# Altium schematic sheet STSPIN32F0A ESC4.SchDoc
size A3
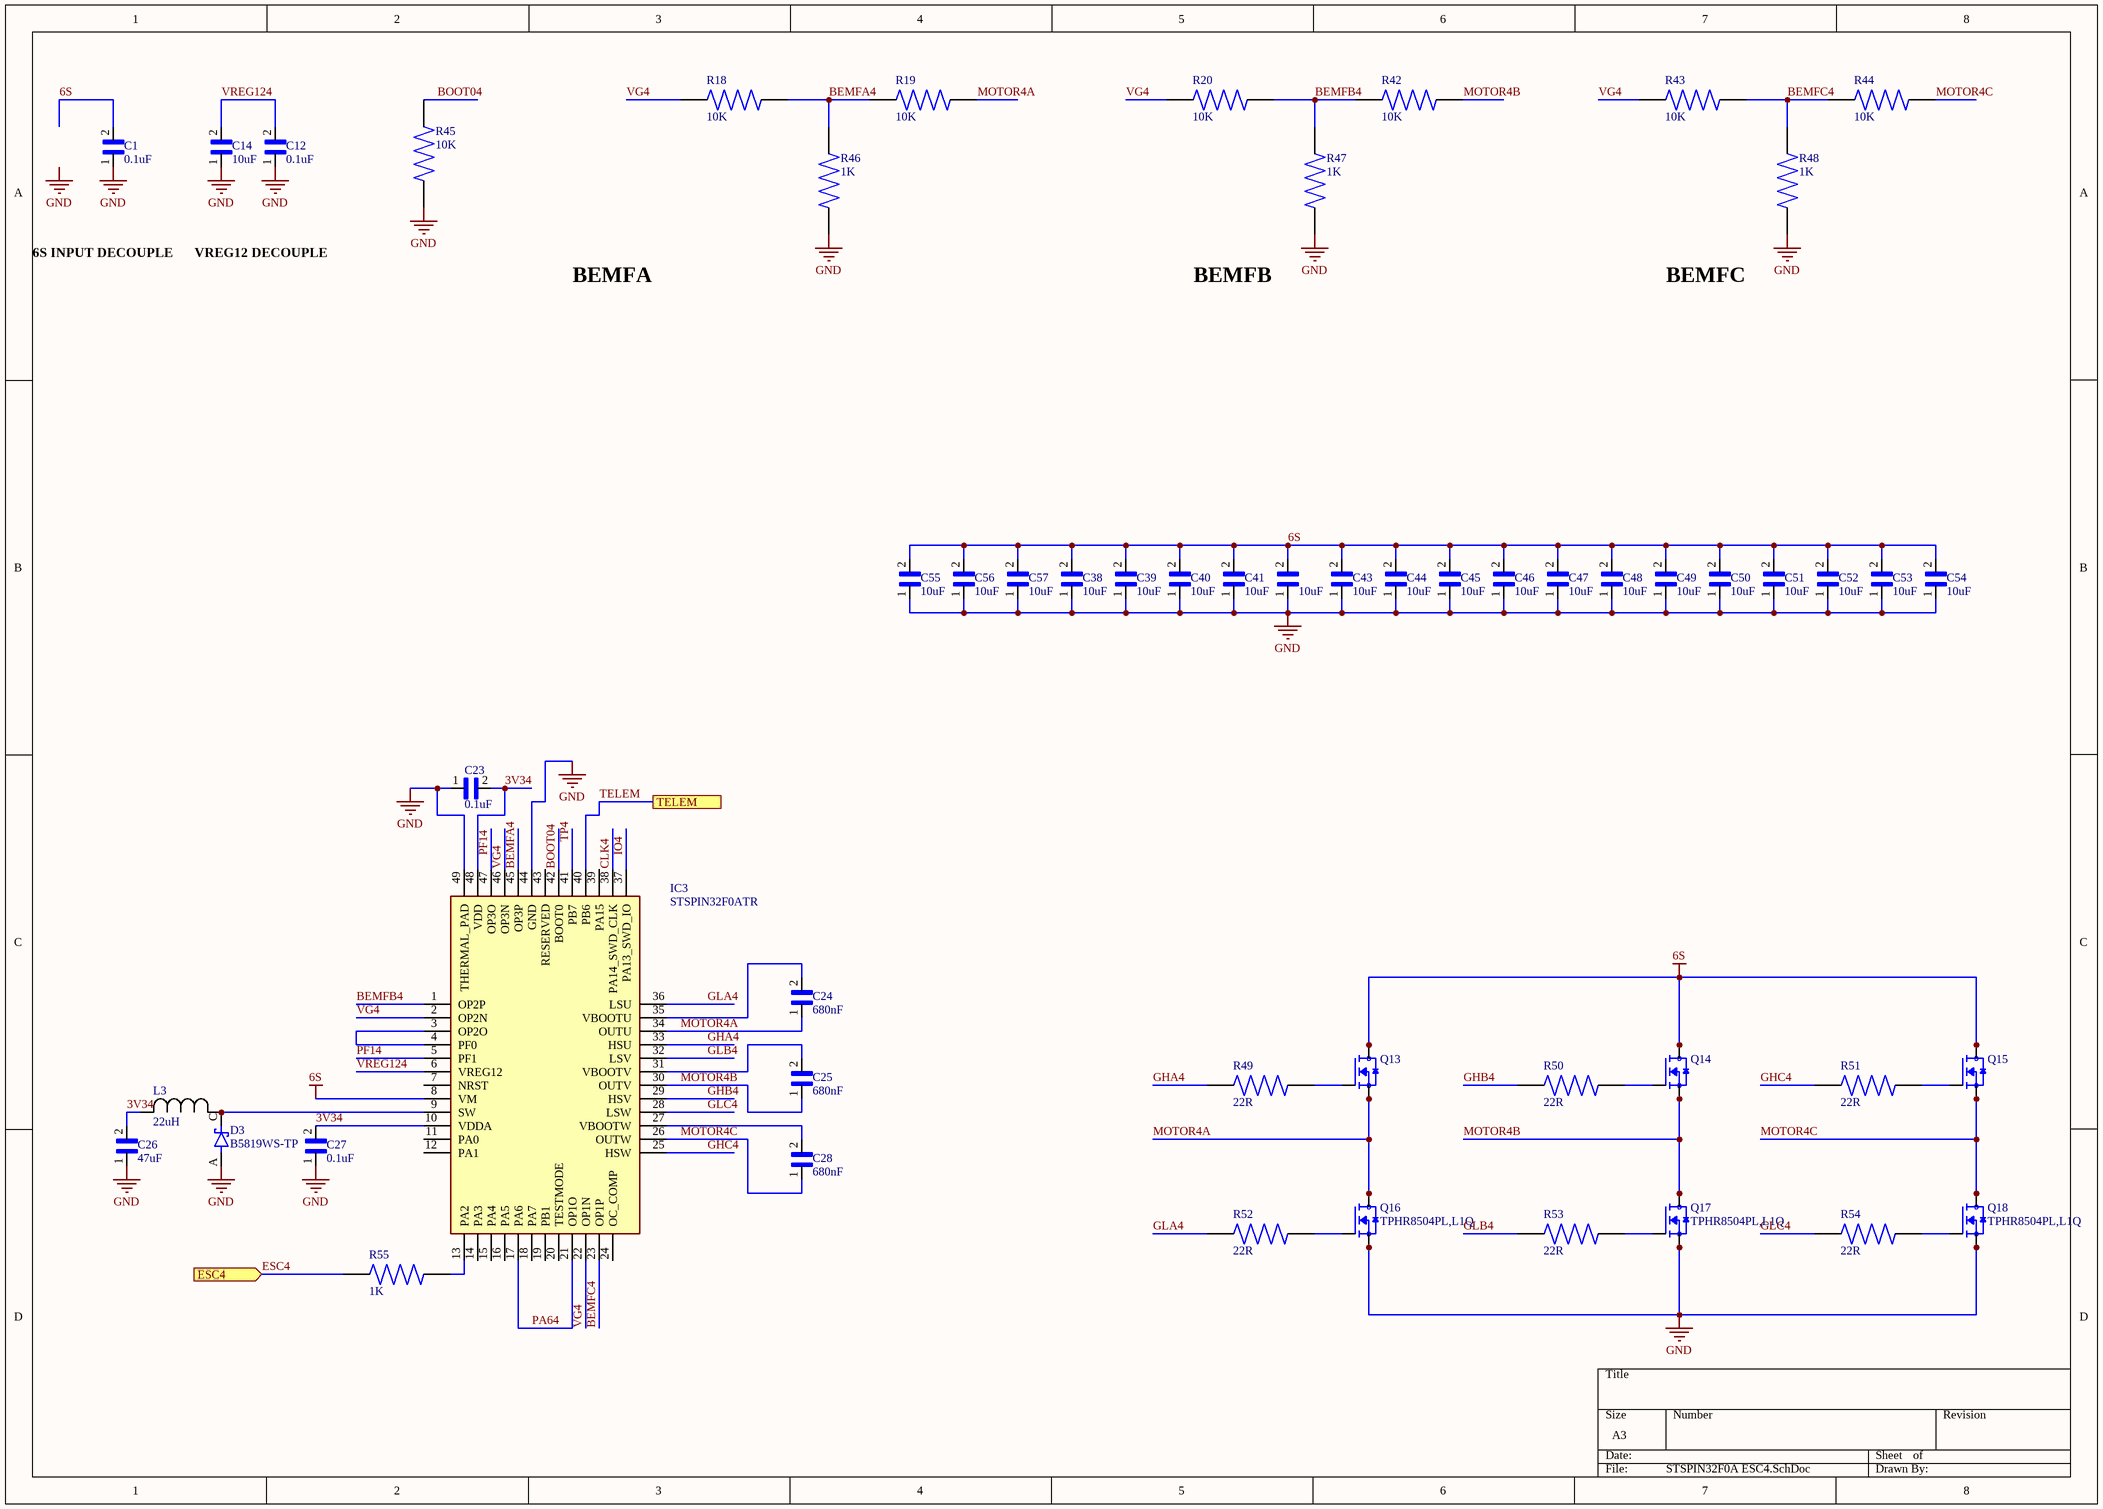
[diagram p0: STSPIN32F0A ESC4.SchDoc]

## Parts
C1  0.1uF  [CAPC1005X55N]
C12  0.1uF  [CAPC1005X55N]
C14  10uF  [CAPC1608X90N]
C23  0.1uF  [CAPC1005X55N]
C24  680nF  [CAPC1005X55N]
C25  680nF  [CAPC1005X55N]
C26  47uF  [CAPC1608X90N]
C27  0.1uF  [CAPC1005X55N]
C28  680nF  [CAPC1005X55N]
C38  10uF  [CAPC3216X190N]
C39  10uF  [CAPC3216X190N]
C40  10uF  [CAPC3216X190N]
C41  10uF  [CAPC3216X190N]
C42  10uF  [CAPC3216X190N]
C43  10uF  [CAPC3216X190N]
C44  10uF  [CAPC3216X190N]
C45  10uF  [CAPC3216X190N]
C46  10uF  [CAPC3216X190N]
C47  10uF  [CAPC3216X190N]
C48  10uF  [CAPC3216X190N]
C49  10uF  [CAPC3216X190N]
C50  10uF  [CAPC3216X190N]
C51  10uF  [CAPC3216X190N]
C52  10uF  [CAPC3216X190N]
C53  10uF  [CAPC3216X190N]
C54  10uF  [CAPC3216X190N]
C55  10uF  [CAPC3216X190N]
C56  10uF  [CAPC3216X190N]
C57  10uF  [CAPC3216X190N]
D3  B5819WS-TP  [SOD2512X115N]
IC3  STSPIN32F0ATR  [QFN50P700X700X100-49N-D]
L3  22uH  [IND_BOURNS_SRN3015]
Q13  TPHR8504PL,L1Q  [TRANS_TPHR8504PL,L1Q]  (value not drawn)
Q14  TPHR8504PL,L1Q  [TRANS_TPHR8504PL,L1Q]  (value not drawn)
Q15  TPHR8504PL,L1Q  [TRANS_TPHR8504PL,L1Q]  (value not drawn)
Q16  TPHR8504PL,L1Q  [TRANS_TPHR8504PL,L1Q]
Q17  TPHR8504PL,L1Q  [TRANS_TPHR8504PL,L1Q]
Q18  TPHR8504PL,L1Q  [TRANS_TPHR8504PL,L1Q]
R18  10K  [RESC1005X37N]
R19  10K  [RESC1005X37N]
R20  10K  [RESC1005X37N]
R42  10K  [RESC1005X37N]
R43  10K  [RESC1005X37N]
R44  10K  [RESC1005X37N]
R45  10K  [RESC1005X37N]
R46  1K  [RESC1005X37N]
R47  1K  [RESC1005X37N]
R48  1K  [RESC1005X37N]
R49  22R  [RESC1005X37N]
R50  22R  [RESC1005X37N]
R51  22R  [RESC1005X37N]
R52  22R  [RESC1005X37N]
R53  22R  [RESC1005X37N]
R54  22R  [RESC1005X37N]
R55  1K  [RESC1005X37N]

## Ports
ESC4 (in), TELEM

## Nets
6S: C1.2 C38.2 C39.2 C40.2 C41.2 C42.2 C43.2 C44.2 C45.2 C46.2 C47.2 C48.2 C49.2 C50.2 C51.2 C52.2 C53.2 C54.2 C55.2 C56.2 C57.2 IC3.8(VM) Q13.5(D) Q13.6(D) Q13.7(D) Q13.8(D) Q13.9(D) Q14.5(D) Q14.6(D) Q14.7(D) Q14.8(D) Q14.9(D) Q15.5(D) Q15.6(D) Q15.7(D) Q15.8(D) Q15.9(D)
GND: C1.1 C12.1 C14.1 C23.1 C26.1 C27.1 C38.1 C39.1 C40.1 C41.1 C42.1 C43.1 C44.1 C45.1 C46.1 C47.1 C48.1 C49.1 C50.1 C51.1 C52.1 C53.1 C54.1 C55.1 C56.1 C57.1 D3.A IC3.44(GND) IC3.49(THERMAL_PAD) Q16.1(S) Q16.2(S) Q16.3(S) Q17.1(S) Q17.2(S) Q17.3(S) Q18.1(S) Q18.2(S) Q18.3(S) R45.1 R46.2 R47.2 R48.2
3V34: C23.2 C26.2 C27.2 IC3.10(VDDA) IC3.48(VDD) L3.2
BEMFA4: IC3.45(OP3P) R18.1 R19.2 R46.1
BEMFB4: IC3.1(OP2P) R20.1 R42.2 R47.1
BEMFC4: IC3.23(OP1P) R43.1 R44.2 R48.1
BOOT04: IC3.42(BOOT0) R45.2
CLK4: IC3.38(PA14_SWD_CLK)
ESC4: R55.1 ; port ESC4
GHA4: IC3.33(HSU) R49.2
GHB4: IC3.29(HSV) R50.2
GHC4: IC3.25(HSW) R51.2
GLA4: IC3.36(LSU) R52.2
GLB4: IC3.32(LSV) R53.2
GLC4: IC3.28(LSW) R54.2
IO4: IC3.37(PA13_SWD_IO)
MOTOR4A: C24.1 IC3.34(OUTU) Q13.1(S) Q13.2(S) Q13.3(S) Q16.5(D) Q16.6(D) Q16.7(D) Q16.8(D) Q16.9(D) R19.1
MOTOR4B: C25.1 IC3.30(OUTV) Q14.1(S) Q14.2(S) Q14.3(S) Q17.5(D) Q17.6(D) Q17.7(D) Q17.8(D) Q17.9(D) R42.1
MOTOR4C: C28.1 IC3.26(OUTW) Q15.1(S) Q15.2(S) Q15.3(S) Q18.5(D) Q18.6(D) Q18.7(D) Q18.8(D) Q18.9(D) R44.1
PA64: IC3.17(PA6) IC3.21(OP1O)
PF14: IC3.5(PF1) IC3.47(OP3O)
TELEM: IC3.40(PB6) ; port TELEM
TP4: IC3.41(PB7)
VG4: IC3.2(OP2N) IC3.22(OP1N) IC3.46(OP3N) R18.2 R20.2 R43.2
VREG124: C12.2 C14.2 IC3.6(VREG12)
NetC24_2: C24.2 IC3.35(VBOOTU)
NetC25_2: C25.2 IC3.31(VBOOTV)
NetC28_2: C28.2 IC3.27(VBOOTW)
NetD3_C: D3.C(K) IC3.9(SW) L3.1
NetIC3_3: IC3.3(OP2O) IC3.4(PF0)
NetIC3_13: IC3.13(PA2) R55.2
NetQ13_4: Q13.4(G) R49.1
NetQ14_4: Q14.4(G) R50.1
NetQ15_4: Q15.4(G) R51.1
NetQ16_4: Q16.4(G) R52.1
NetQ17_4: Q17.4(G) R53.1
NetQ18_4: Q18.4(G) R54.1

Not connected (* = marked no-connect by the designer): IC3 7(NRST) 11(PA0) 12(PA1) 14(PA3) 15(PA4) 16(PA5) 18(PA7) 19(PB1) 20(TESTMODE) 24(OC_COMP) 39(PA15) 43(RESERVED)

## Notes on the sheet
- 6S INPUT DECOUPLE
- VREG12 DECOUPLE
- BEMFA
- BEMFB
- BEMFC
- Labels drawn without touching a wire or pin: GND

## Library data of the parts
C1 C12 C23-C25 C27 C28 = GRM1555C1H222JA01D: Package: None; Price: None; Value: *; MP: GRM1555C1H222JA01D; Availability: Unavailable
C14 C26 = GRM188R71E224JA88D: SMD Capacitor X7R(EIA) with Capacitance: 0.22uF Tol. 5%. Rated Voltage: 25Vdc; Package: None; Price: None; Value: *; MP: GRM188R71E224JA88D; Availability: Unavailable
C38-C57 = GRM31CC80G227ME11K: Ceramic Capacitor; Package: None; Price: None; Value: *; MP: GRM31CC80G227ME11K; Availability: Unavailable
D3 = B5819WS-TP: MF: {'manufacturer': u'Micro Commercial Components'}; Package: None; MP: B5819WS-TP; Price: None; Availability: Unavailable; Value: *
IC3 = STSPIN32F0ATR: Integrated Circuit; Manufacturer_Name: STMicroelectronics; Datasheet Link: http://www.st.com/content/ccc/resource/technical/document/datasheet/group3/3d/88/0f/d1/3f/0c/49/80/DM00406030/files/DM00406030.pdf/jcr:content/translations/en.DM00406030.pdf; Height: 1mm; Manufacturer_Part_Number: STSPIN32F0ATR; Mouser Part Number: 511-STSPIN32F0ATR; Mouser Price/Stock: https://www.mouser.co.uk/ProductDetail/STMicroelectronics/STSPIN32F0ATR?qs=1mbolxNpo8flc7yUpKWOVQ%3D%3D; Arrow Part Number: STSPIN32F0ATR; Arrow Price/Stock: https://www.arrow.com/en/products/stspin32f0atr/stmicroelectronics
L3 = SRN3015-220M: No Description Available; Mfr_Name: Bourns Electronics; Type: DEV; Copyright: Copyright (C) 2022 Ultra Librarian. All rights reserved.; Manufacturer_Part_Number: SRN3015-220M; Digi-Key_Part_Number_1: SRN3015-220MCT-ND; Digi-Key_Part_Number_2: SRN3015-220MDKR-ND; Digi-Key_Part_Number_3: SRN3015-220MTR-ND; RefDes: RefDes
Q13-Q18 = TPHR8504PL,L1Q: N-Channel 40V 150A (Tc) 1W (Ta), 170W (Tc) Surface Mount 8-SOP Advance (5x5); MF: Toshiba Semiconductor; Package: SOP-8 Toshiba; Price: None; Value: *; MP: TPHR8504PL,L1Q; SnapEDA_Link: https://www.snapeda.com/parts/TPHR8504PL,L1Q/Toshiba%20Semiconductor%20and%20Storage/view-part/604439/?ref=snap; Availability: Unavailable
R18-R20 R42-R55 = RE0402BRE07330KL: MF: {'manufacturer': u'Yageo'}; Availability: Unavailable; Package: None; MP: RE0402BRE07330KL; Value: *; Price: None